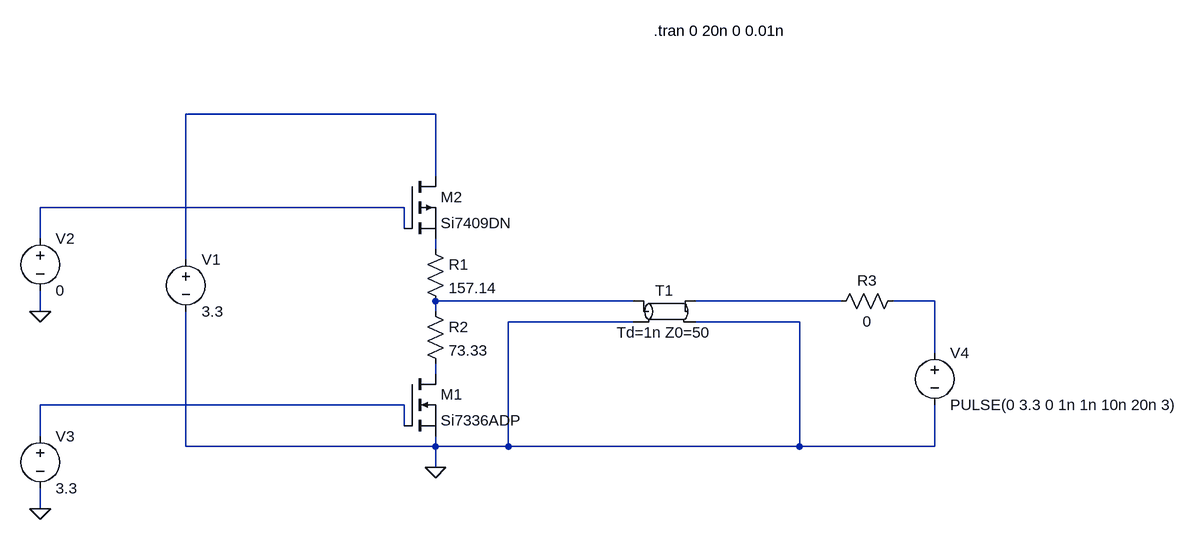
[diagram p0: schematic Draft2.asc]
Draft2.asc, the LTspice schematic file:
Version 4
SHEET 1 1372 680
WIRE 208 -160 -176 -160
WIRE 208 -64 208 -160
WIRE 160 -16 -400 -16
WIRE 160 16 160 -16
WIRE -400 32 -400 -16
WIRE 208 48 208 32
WIRE -176 64 -176 -160
WIRE 512 128 208 128
WIRE 832 128 608 128
WIRE 976 128 912 128
WIRE -400 144 -400 112
WIRE 208 144 208 128
WIRE 512 160 320 160
WIRE 768 160 608 160
WIRE 976 208 976 128
WIRE 208 240 208 224
WIRE 160 288 -400 288
WIRE 160 320 160 288
WIRE -400 336 -400 288
WIRE -176 352 -176 144
WIRE 208 352 208 336
WIRE 208 352 -176 352
WIRE 320 352 320 160
WIRE 320 352 208 352
WIRE 768 352 768 160
WIRE 768 352 320 352
WIRE 976 352 976 288
WIRE 976 352 768 352
WIRE 208 384 208 352
WIRE -400 448 -400 416
FLAG 208 384 0
FLAG -400 448 0
FLAG -400 144 0
SYMBOL res 192 32 R0
SYMATTR InstName R1
SYMATTR Value 157.14
SYMBOL res 192 128 R0
SYMATTR InstName R2
SYMATTR Value 73.33
SYMBOL voltage -176 48 R0
SYMATTR InstName V1
SYMATTR Value 3.3
SYMBOL voltage -400 16 R0
SYMATTR InstName V2
SYMATTR Value 0
SYMBOL voltage -400 320 R0
SYMATTR InstName V3
SYMATTR Value 3.3
SYMBOL tline 560 144 R0
SYMATTR InstName T1
SYMATTR Value Td=1n Z0=50
SYMBOL voltage 976 192 R0
WINDOW 123 0 0 Left 0
WINDOW 39 0 0 Left 0
SYMATTR InstName V4
SYMATTR Value PULSE(0 3.3 0 1n 1n 10n 20n 3)
SYMBOL res 928 112 R90
WINDOW 0 0 56 VBottom 2
WINDOW 3 32 56 VTop 2
SYMATTR InstName R3
SYMATTR Value 0
SYMBOL nmos 160 240 R0
SYMATTR InstName M1
SYMATTR Value Si7336ADP
SYMBOL pmos 160 -64 R0
SYMATTR InstName M2
SYMATTR Value Si7409DN
TEXT 544 -288 Left 2 !.tran 0 20n 0 0.01n

The netlist it stands for:
* Draft2.asc
R1 N003 N004 157.14
R2 N004 N007 73.33
V1 N001 0 3.3
V2 N002 0 0
V3 N008 0 3.3
T1 N004 0 N005 0 Td=1n Z0=50
V4 N006 0 PULSE(0 3.3 0 1n 1n 10n 20n 3)
R3 N006 N005 0
M1 N007 N008 0 0 Si7336ADP
M2 N001 N002 N003 N003 Si7409DN
.model NMOS NMOS
.model PMOS PMOS
.lib standard.mos
.tran 0 20n 0 0.01n
.backanno
.end